# Altium project STM32F1_ROV600.PrjPCB
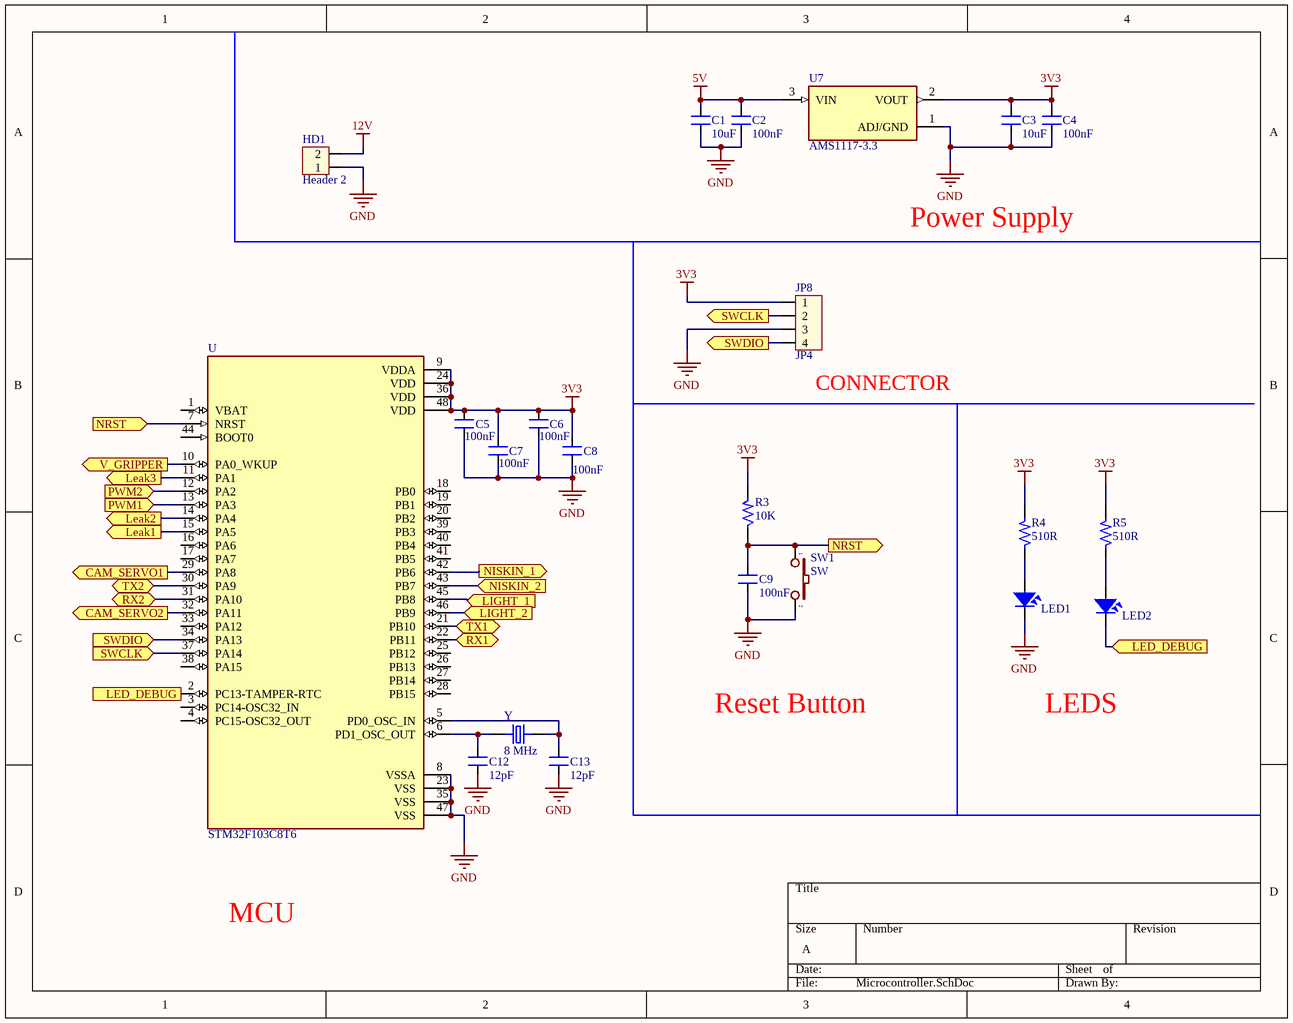
[diagram p0: Microcontroller.SchDoc]
3 sheets, 106 parts. Net scope: flat (ports and power ports of the same name join across sheets).
Board file: Layout.PcbDoc
Sheets:
  Microcontroller.SchDoc
  Peripheral.SchDoc
  XL4015.SchDoc

## Sheet Microcontroller.SchDoc
size A

### Parts
C1  10uF  [SM-0805]
C2  100nF  [SM-0805]
C3  10uF  [SM-0805]
C4  100nF  [SM-0805]
C5  100nF  [SM-0805]
C6  100nF  [SM-0805]
C7  100nF  [SM-0805]
C8  100nF  [SM-0805]
C9  100nF  [SM-0805]
C12  12pF  [SM-0805]
C13  12pF  [SM-0805]
HD1  Header 2  [HED2]
JP8  JP4  [JP4]
LED1  LED SMD  [SM-LED-0805-Blue]  (value not drawn)
LED2  LED SMD  [SM-LED-0805-Yellow]  (value not drawn)
R3  10K  [SM-RES-0805]
R4  510R  [SM-RES-0805]
R5  510R  [SM-RES-0805]
SW1  SW  [SW2]
U  STM32F103C8T6  [QFP50P900X900X160-48N]
U7  AMS1117-3.3  [SOT229P700X180-4N]
Y  8 MHz  [XTAL_ECS-120.003-18-5P-TR]

### Ports
CAM_SERVO1 (out), CAM_SERVO2 (out), Leak1 (out), Leak2 (out), Leak3 (out), LED_DEBUG (in), LED_DEBUG (out), LIGHT_1 (in), LIGHT_2 (in), NISKIN_1 (out), NISKIN_2 (in), NRST (in), NRST (out), PWM1 (in), PWM2 (in), RX1 (bidir), RX2 (bidir), SWCLK (in), SWCLK (out), SWDIO (in), SWDIO (out), TX1 (bidir), TX2 (bidir), V_GRIPPER (out)

### Nets
3V3: C3.2 C4.2 C5.2 C6.2 C7.2 C8.2 JP8.1 R3.2 R4.2 R5.2 U.9(VDDA) U.24(VDD) U.36(VDD) U.48(VDD) U7.2(VOUT)
5V: C1.2 C2.2 U7.3(VIN)
12V: HD1.2
GND: C1.1 C2.1 C3.1 C4.1 C5.1 C6.1 C7.1 C8.1 C9.1 C12.1 C13.1 HD1.1 JP8.3 LED1.2 SW1.2 U.8(VSSA) U.23(VSS) U.35(VSS) U.47(VSS) U7.1(ADJ/GND)
NetC9_2: C9.2 R3.1 SW1.1 U.7(NRST) ; port NRST
NetC12_2: C12.2 U.6(PD1_OSC_OUT) Y.1
NetC13_2: C13.2 U.5(PD0_OSC_IN) Y.2
NetJP1_2: U.15(PA5) ; port Leak1
NetJP2_2: U.14(PA4) ; port Leak2
NetJP3_2: U.11(PA1) ; port Leak3
NetJP4_1: U.32(PA11) ; port CAM_SERVO2
NetJP5_2: U.21(PB10) ; port TX1
NetJP5_3: U.22(PB11) ; port RX1
NetJP6_2: U.30(PA9) ; port TX2
NetJP6_3: U.31(PA10) ; port RX2
NetJP7_1: U.29(PA8) ; port CAM_SERVO1
NetJP8_2: JP8.2 U.37(PA14) ; port SWCLK
NetJP8_4: JP8.4 U.34(PA13) ; port SWDIO
NetLED1_1: LED1.1 R4.1
NetLED2_1: LED2.1 R5.1
NetLED2_2: LED2.2 U.2(PC13-TAMPER-RTC) ; port LED_DEBUG
NetLED3_2: U.42(PB6) ; port NISKIN_1
NetLED4_2: U.43(PB7) ; port NISKIN_2
NetLED5_2: U.45(PB8) ; port LIGHT_1
NetLED6_2: U.46(PB9) ; port LIGHT_2
NetU_10: U.10(PA0_WKUP) ; port V_GRIPPER
NetU_12: U.12(PA2) ; port PWM2
NetU_13: U.13(PA3) ; port PWM1

Not connected (* = marked no-connect by the designer): U 1(VBAT) 3(PC14-OSC32_IN) 4(PC15-OSC32_OUT) 16(PA6) 17(PA7) 18(PB0) 19(PB1) 20(PB2) 25(PB12) 26(PB13) 27(PB14) 28(PB15) 33(PA12) 38(PA15) 39(PB3) 40(PB4) 41(PB5) 44(BOOT0)

### Notes on the sheet
- Power Supply
- (near JP8) CONNECTOR
- Reset Button
- LEDS
- MCU

### Library data of the parts
C1-C9 C12 C13 = CM: Cap SMD; Value: 103
HD1 = Hed2: Header 2 (Green); Value: Header 2
JP8 = Con4: Connector 4; Value: Connector 4
LED1 LED2 = LED-SMD-0805
R3-R5 = R: Resistor 1/4W; Value: R1/4W - 1K
SW1 = SW2: Switch button 2 pin; Value: SW chip 2 pin
U = STM32F103C8T6: ARMÂ® CortexÂ®-M3 STM32F1 Microcontroller IC 32-Bit 72MHz 64KB _64K x 8_ FLASH; MF: STMicroelectronics; Price: None; Package: LQFP-48 STMicroelectronics; Value: *; MP: STM32F103C8T6; Availability: Unavailable; SnapEDA_Link: https://www.snapeda.com/parts/STM32F103C8T6/STMicroelectronics/view-part/52195/?ref=snap
U7 = AMS1117-3.3: Sot223/Pkg 1-Amp 3.3-Volt Low Drop Out Voltage Regulatator; MF: Advanced Monolithic Systems; Price: None; Package: None; Value: *; MP: AMS1117-3.3; Availability: Unavailable; SnapEDA_Link: https://www.snapeda.com/parts/AMS1117-3.3/Advanced%20Monolithic%20Systems/view-part/53450/?ref=snap
Y = ECS-120.003-18-5P-TR: MF: ECS International; Package: HC49/US ECS International; Value: *; SnapEDA_Link: https://www.snapeda.com/parts/ECS-120.003-18-5P-TR/ECS%20International/view-part/2547635/?ref=snap; Price: None; MP: ECS-120.003-18-5P-TR; Availability: Unavailable

## Sheet Peripheral.SchDoc
size A
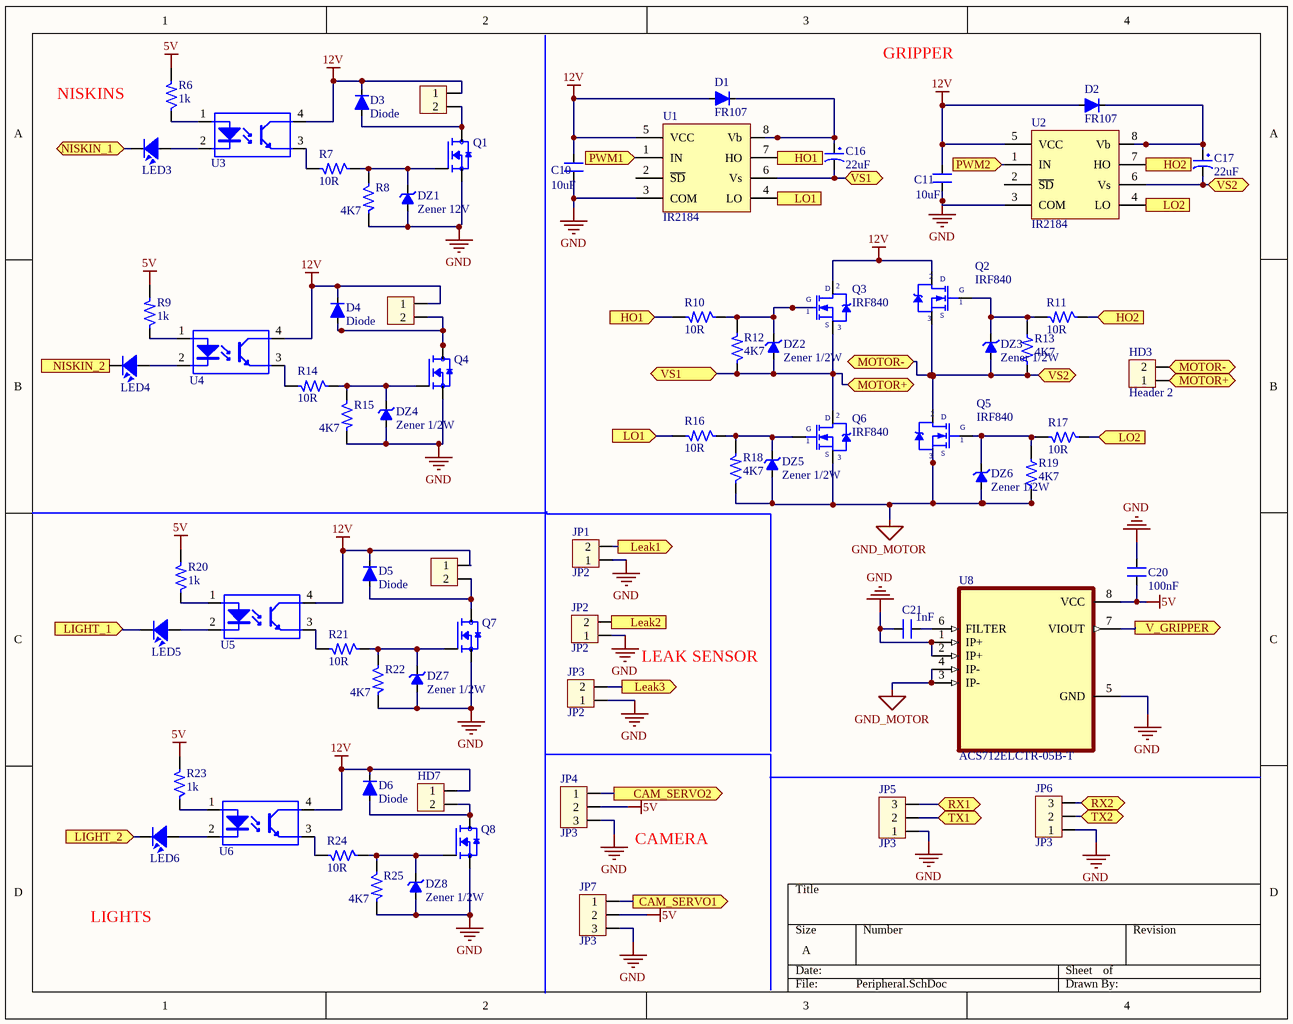
[diagram p1: Peripheral.SchDoc]

### Parts
C10  10uF  [SM-0805]
C11  10uF  [SM-0805]
C16  22uF  [SM-Cap-1206]
C17  22uF  [SM-Cap-1206]
C20  100nF  [SM-0805]
C21  1nF  [SM-0805]
D1  FR107  [SOD323]
D2  FR107  [SOD323]
D3  Diode  [SOD323]
D4  Diode  [SOD323]
D5  Diode  [SOD323]
D6  Diode  [SOD323]
DZ1  Zener 12V  [SOD-80]
DZ2  Zener 1/2W  [SOD-80]
DZ3  Zener 1/2W  [SOD-80]
DZ4  Zener 1/2W  [SOD-80]
DZ5  Zener 1/2W  [SOD-80]
DZ6  Zener 1/2W  [SOD-80]
DZ7  Zener 1/2W  [SOD-80]
DZ8  Zener 1/2W  [SOD-80]
HD3  Header 2  [HED2]
HD4  Header 2  [HED2]  (value not drawn)
HD5  Header 2  [HED2]  (value not drawn)
HD6  Header 2  [HED2]  (value not drawn)
HD7  Header 2  [HED2]  (value not drawn)
JP1  JP2  [CON2]
JP2  JP2  [CON2]
JP3  JP2  [CON2]
JP4  JP3  [CON3]
JP5  JP3  [CON3]
JP6  JP3  [CON3]
JP7  JP3  [CON3]
LED3  LED SMD  [SM-LED-0805-Blue]  (value not drawn)
LED4  LED SMD  [SM-LED-0805-Blue]  (value not drawn)
LED5  LED SMD  [SM-LED-0805-Blue]  (value not drawn)
LED6  LED SMD  [SM-LED-0805-Blue]  (value not drawn)
Q1  IPD025N06N  [DPAK229P994X241-3N]  (value not drawn)
Q2  IRF840  [QTO-220]
Q3  IRF840  [QTO-220]
Q4  IPD025N06N  [DPAK229P994X241-3N]  (value not drawn)
Q5  IRF840  [QTO-220]
Q6  IRF840  [QTO-220]
Q7  IPD025N06N  [DPAK229P994X241-3N]  (value not drawn)
Q8  IPD025N06N  [DPAK229P994X241-3N]  (value not drawn)
R6  1k  [SM-RES-0805]
R7  10R  [SM-RES-0805]
R8  4K7  [SM-RES-0805]
R9  1k  [SM-RES-0805]
R10  10R  [SM-RES-0805]
R11  10R  [SM-RES-0805]
R12  4K7  [SM-RES-0805]
R13  4K7  [SM-RES-0805]
R14  10R  [SM-RES-0805]
R15  4K7  [SM-RES-0805]
R16  10R  [SM-RES-0805]
R17  10R  [SM-RES-0805]
R18  4K7  [SM-RES-0805]
R19  4K7  [SM-RES-0805]
R20  1k  [SM-RES-0805]
R21  10R  [SM-RES-0805]
R22  4K7  [SM-RES-0805]
R23  1k  [SM-RES-0805]
R24  10R  [SM-RES-0805]
R25  4K7  [SM-RES-0805]
U1  IR2184  [SO-8]
U2  IR2184  [SO-8]
U3  OPTO  [DIP4/W0.3]  (value not drawn)
U4  OPTO  [DIP4/W0.3]  (value not drawn)
U5  OPTO  [DIP4/W0.3]  (value not drawn)
U6  OPTO  [DIP4/W0.3]  (value not drawn)
U8  ACS712ELCTR-05B-T  [SOIC127P600X175-8N]

### Ports
CAM_SERVO1 (out), CAM_SERVO2 (out), HO1 (in), HO1 (out), HO2 (in), HO2 (out), Leak1 (out), Leak2 (out), Leak3 (out), LIGHT_1 (in), LIGHT_2 (in), LO1 (in), LO1 (out), LO2 (in), LO2 (out), MOTOR+ (bidir), MOTOR- (bidir), NISKIN_1 (bidir), NISKIN_2 (in), PWM1 (in), PWM2 (in), RX1 (bidir), RX2 (bidir), TX1 (bidir), TX2 (bidir), V_GRIPPER (out), VS1 (bidir), VS2 (bidir)

### Nets
5V: C20.1 JP4.2 JP7.2 R6.2 R9.2 R20.2 R23.2 U8.8(VCC)
12V: C10.2 C11.2 D1.1(Anode) D2.1(Anode) D3.2(Cathode) D4.2(Cathode) D5.2(Cathode) D6.2(Cathode) HD4.1 HD5.1 HD6.1 HD7.1 Q2.2(D) Q3.2(D) U1.5(VCC) U2.5(VCC) U3.4(C) U4.4(C) U5.4(C) U6.4(C)
GND: C10.1 C11.1 C20.2 C21.2 DZ1.1(Cathode) DZ4.1(Cathode) DZ7.1(Cathode) DZ8.1(Cathode) JP1.1 JP2.1 JP3.1 JP4.3 JP5.1 JP6.1 JP7.3 Q1.3(S) Q4.3(S) Q7.3(S) Q8.3(S) R8.2 R15.2 R22.2 R25.2 U1.3(COM) U2.3(COM) U8.1(IP+) U8.2(IP+) U8.5(GND)
GND_MOTOR: DZ5.1(Cathode) DZ6.1(Cathode) Q5.3(S) Q6.3(S) R18.1 R19.1 U8.3(IP-) U8.4(IP-)
NetC16_1: C16.1 D1.2(Cathode) U1.8(Vb)
NetC16_2: C16.2 DZ2.1(Cathode) HD3.1 Q3.3(S) Q6.2(D) R12.1 U1.6(Vs) ; port VS1, port MOTOR+
NetC17_1: C17.1 D2.2(Cathode) U2.8(Vb)
NetC17_2: C17.2 DZ3.1(Cathode) HD3.2 Q2.3(S) Q5.2(D) R13.1 U2.6(Vs) ; port VS2, port MOTOR-
NetC21_1: C21.1 U8.6(FILTER)
NetD3_1: D3.1(Anode) HD4.2 Q1.TAB(D)
NetD4_1: D4.1(Anode) HD5.2 Q4.TAB(D)
NetD5_1: D5.1(Anode) HD6.2 Q7.TAB(D)
NetD6_1: D6.1(Anode) HD7.2 Q8.TAB(D)
NetDZ1_2: DZ1.2(Anode) Q1.1(G) R7.1 R8.1
NetDZ2_2: DZ2.2(Anode) Q3.1(G) R10.1 R12.2
NetDZ3_2: DZ3.2(Anode) Q2.1(G) R11.2 R13.2
NetDZ4_2: DZ4.2(Anode) Q4.1(G) R14.1 R15.1
NetDZ5_2: DZ5.2(Anode) Q6.1(G) R16.1 R18.2
NetDZ6_2: DZ6.2(Anode) Q5.1(G) R17.2 R19.2
NetDZ7_2: DZ7.2(Anode) Q7.1(G) R21.1 R22.1
NetDZ8_2: DZ8.2(Anode) Q8.1(G) R24.1 R25.1
NetJP1_2: JP1.2 ; port Leak1
NetJP2_2: JP2.2 ; port Leak2
NetJP3_2: JP3.2 ; port Leak3
NetJP4_1: JP4.1 ; port CAM_SERVO2
NetJP5_2: JP5.2 ; port TX1
NetJP5_3: JP5.3 ; port RX1
NetJP6_2: JP6.2 ; port TX2
NetJP6_3: JP6.3 ; port RX2
NetJP7_1: JP7.1 ; port CAM_SERVO1
NetLED3_1: LED3.1 U3.2(K)
NetLED3_2: LED3.2 ; port NISKIN_1
NetLED4_1: LED4.1 U4.2(K)
NetLED4_2: LED4.2 ; port NISKIN_2
NetLED5_1: LED5.1 U5.2(K)
NetLED5_2: LED5.2 ; port LIGHT_1
NetLED6_1: LED6.1 U6.2(K)
NetLED6_2: LED6.2 ; port LIGHT_2
NetR6_1: R6.1 U3.1(A)
NetR7_2: R7.2 U3.3(E)
NetR9_1: R9.1 U4.1(A)
NetR10_2: R10.2 U1.7(HO) ; port HO1
NetR11_1: R11.1 U2.7(HO) ; port HO2
NetR14_2: R14.2 U4.3(E)
NetR16_2: R16.2 U1.4(LO) ; port LO1
NetR17_1: R17.1 U2.4(LO) ; port LO2
NetR20_1: R20.1 U5.1(A)
NetR21_2: R21.2 U5.3(E)
NetR23_1: R23.1 U6.1(A)
NetR24_2: R24.2 U6.3(E)
NetU_10: U8.7(VIOUT) ; port V_GRIPPER
NetU_12: U2.1(IN) ; port PWM2
NetU_13: U1.1(IN) ; port PWM1

Not connected (* = marked no-connect by the designer): U1 2(~{SD}); U2 2(~{SD})

### Notes on the sheet
- NISKINS
- GRIPPER
- LEAK SENSOR
- CAMERA
- LIGHTS

### Library data of the parts
C10 C11 C21 = CM: Cap SMD; Value: 103
C16 C17 = CP1: Cap P  0,1uF < 22uF , 16 - 50V; Value: 10uF/50V; Description 1: 10 => 220uF/6,3V/10V - 10uF => 100uF/16V; Description 2: 0,1uF => 33uF/50V - 10uF => 22uF/63V; Description 3: 0,47uF => 10uF/100V
C20 = CN2: Cap np 104 => 105pF; Value: 0.1uF
D1-D6 = Diode SMD
DZ1-DZ8 = Zener SMD
HD3-HD7 = Hed2: Header 2 (Green); Value: Header 2
JP1-JP3 = Con2: Connector 2; Value: Connector 2
JP4-JP7 = Con3: Connector 3; Value: Connector 3
LED3-LED6 = LED-SMD-0805
Q1 Q4 Q7 Q8 = IPD025N06N: N-Channel 60V 90A _Tc_ 3W _Ta_, 167W _Tc_ Surface Mount PG-TO252-3; MF: Infineon Technologies; Package: TO-252-3 Infineon Technologies; MP: IPD025N06N; Value: *; SnapEDA_Link: https://www.snapeda.com/parts/IPD025N06N/Infineon%20Technologies/view-part/666018/?ref=snap; Price: None; Availability: Unavailable
Q2 Q3 Q5 Q6 = IRF840: MOSFET N - CHANNEL 500V - 0.75 - 8A - TO-220; Value: IRF840
R6-R25 = R: Resistor 1/4W; Value: R1/4W - 1K
U1 U2 = IR2184: Half-Bridge Driver
U8 = ACS712ELCTR-05B-T: Current Sensor 5A 1 Channel Hall Effect, Open Loop Bidirectional 8-SOIC _0.154, 3.90mm Width_; MF: Allegro MicroSystems LLC; MP: ACS712ELCTR-05B-T; Digi-Key_Part_Number: 620-1189-1-ND; Package: SOIC-8 Allegro MicroSystems LLC; Digi-Key_Purchase_URL: https://www.digikey.in/product-detail/en/allegro-microsystems/ACS712ELCTR-05B-T/620-1189-1-ND/1284606?utm_source=snapeda&utm_medium=aggregator&utm_campaign=symbol; Value: *; SnapEDA_Link: https://www.snapeda.com/parts/ACS712ELCTR-05B-T/Allegro%20MicroSystems%20LLC/view-part/46765/?ref=snap

## Sheet XL4015.SchDoc
size A3
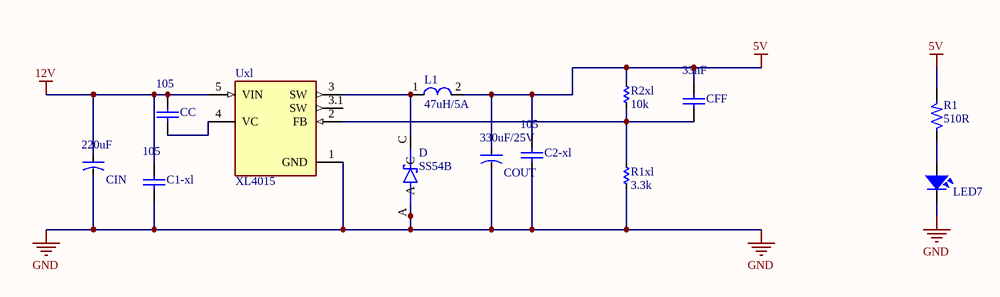
[diagram p2: XL4015.SchDoc]

### Parts
C1-xl  105  [C0805]
C2-xl  105  [C0805]
CC  105  [C0805]
CFF  33nF  [C0805]
CIN  220uF  [CAP-ALU-SMD-6.3x7.7x2.2]
COUT  330uF/25V  [CAP-ALU-SMD-F]
D  SS54B  [DIOM4336X244N]
L1  47uH/5A  [L-DIP-M-18.5x8]
LED7  LED SMD  [SM-LED-0805-Blue]  (value not drawn)
R1  510R  [SM-RES-0805]
R1xl  3.3k  [RES-SMD-0805]
R2xl  10k  [RES-SMD-0805]
Uxl  XL4015  [CONV_XL4015]

### Nets
5V: C2-xl.2 CFF.2 COUT.1 L1.2 R1.2 R2xl.1
12V: C1-xl.2 CC.2 CIN.1 Uxl.5(VIN)
GND: C1-xl.1 C2-xl.1 CIN.2 COUT.2 D.A LED7.2 R1xl.2 Uxl.1(GND)
NetCC_1: CC.1 Uxl.4(VC)
NetCFF_1: CFF.1 R1xl.1 R2xl.2 Uxl.2(FB)
NetD_C: D.C L1.1 Uxl.3(SW)
NetLED7_1: LED7.1 R1.1

Not connected (* = marked no-connect by the designer): Uxl 3.1(SW)

### Library data of the parts
C1-xl C2-xl CC CFF = CapSMD: Capacitor; Value: 33p; Published: 8-Jun-2000; LatestRevisionDate: 17-Jul-2002; LatestRevisionNote: Re-released for DXP Platform.; PackageReference: RAD-0.3; Publisher: Altium Limited
CIN COUT = CN-ALU-SMD: Polarized Capacitor (Axial); Published: 8-Jun-2000; LatestRevisionDate: 17-Jul-2002; LatestRevisionNote: Re-released for DXP Platform.; PackageReference: POLAR0.8; Publisher: Altium Limited
D = SS54B: Diode Schottky 40V 5A Surface Mount SMBF; MF: JCET; SnapEDA_Link: https://www.snapeda.com/parts/SS54B/JCET/view-part/105689/?ref=snap; Price: None; Availability: Unavailable; Package: None; MP: SS54B; Value: *
L1 = L-SMD-1: partNo: 78477010; Manufacturer: Wurth Elektronik; Inductance: 1.0 μH; ComponentLink1Description: Manufacturer; ComponentLink1URL: http://www.we-online.de; Created by: Baojun Chen; Created Date: Nov.2015; ComponentLink2Description: Datasheet; ComponentLink2URL: http://katalog.we-online.de/pbs/datasheet/78477010.pdf
LED7 = LED-SMD-0805
R1 = R: Resistor 1/4W; Value: R1/4W - 1K
R1xl R2xl = Res-SMD: Resistor; Manufacturer: Generic Components; Class: Passive; Published: 08/06/2000; Publisher: Altium Hobart Technology Centre
Uxl = XL4015: 5A 180KHz 36V Buck DC to DC Converter; MF: XLSEMI; Value: *; Availability: Unavailable; Price: None; SnapEDA_Link: https://www.snapeda.com/parts/XL4015/XLSEMI/view-part/4725363/?ref=snap; Package: Package; MP: XL4015

## Nets that join several sheets
5V: Microcontroller (C1.2 C2.2 U7.3), Peripheral (8 pins), XL4015 (6 pins)
12V: Microcontroller (HD1.2), Peripheral (20 pins), XL4015 (C1-xl.2 CC.2 CIN.1 Uxl.5)
GND: Microcontroller (20 pins), Peripheral (28 pins), XL4015 (8 pins)
NetJP1_2: Microcontroller (U.15), Peripheral (JP1.2)
NetJP2_2: Microcontroller (U.14), Peripheral (JP2.2)
NetJP3_2: Microcontroller (U.11), Peripheral (JP3.2)
NetJP4_1: Microcontroller (U.32), Peripheral (JP4.1)
NetJP5_2: Microcontroller (U.21), Peripheral (JP5.2)
NetJP5_3: Microcontroller (U.22), Peripheral (JP5.3)
NetJP6_2: Microcontroller (U.30), Peripheral (JP6.2)
NetJP6_3: Microcontroller (U.31), Peripheral (JP6.3)
NetJP7_1: Microcontroller (U.29), Peripheral (JP7.1)
NetLED3_2: Microcontroller (U.42), Peripheral (LED3.2)
NetLED4_2: Microcontroller (U.43), Peripheral (LED4.2)
NetLED5_2: Microcontroller (U.45), Peripheral (LED5.2)
NetLED6_2: Microcontroller (U.46), Peripheral (LED6.2)
NetU_10: Microcontroller (U.10), Peripheral (U8.7)
NetU_12: Microcontroller (U.12), Peripheral (U2.1)
NetU_13: Microcontroller (U.13), Peripheral (U1.1)